# Altium project Z7_Lite.PrjPcb
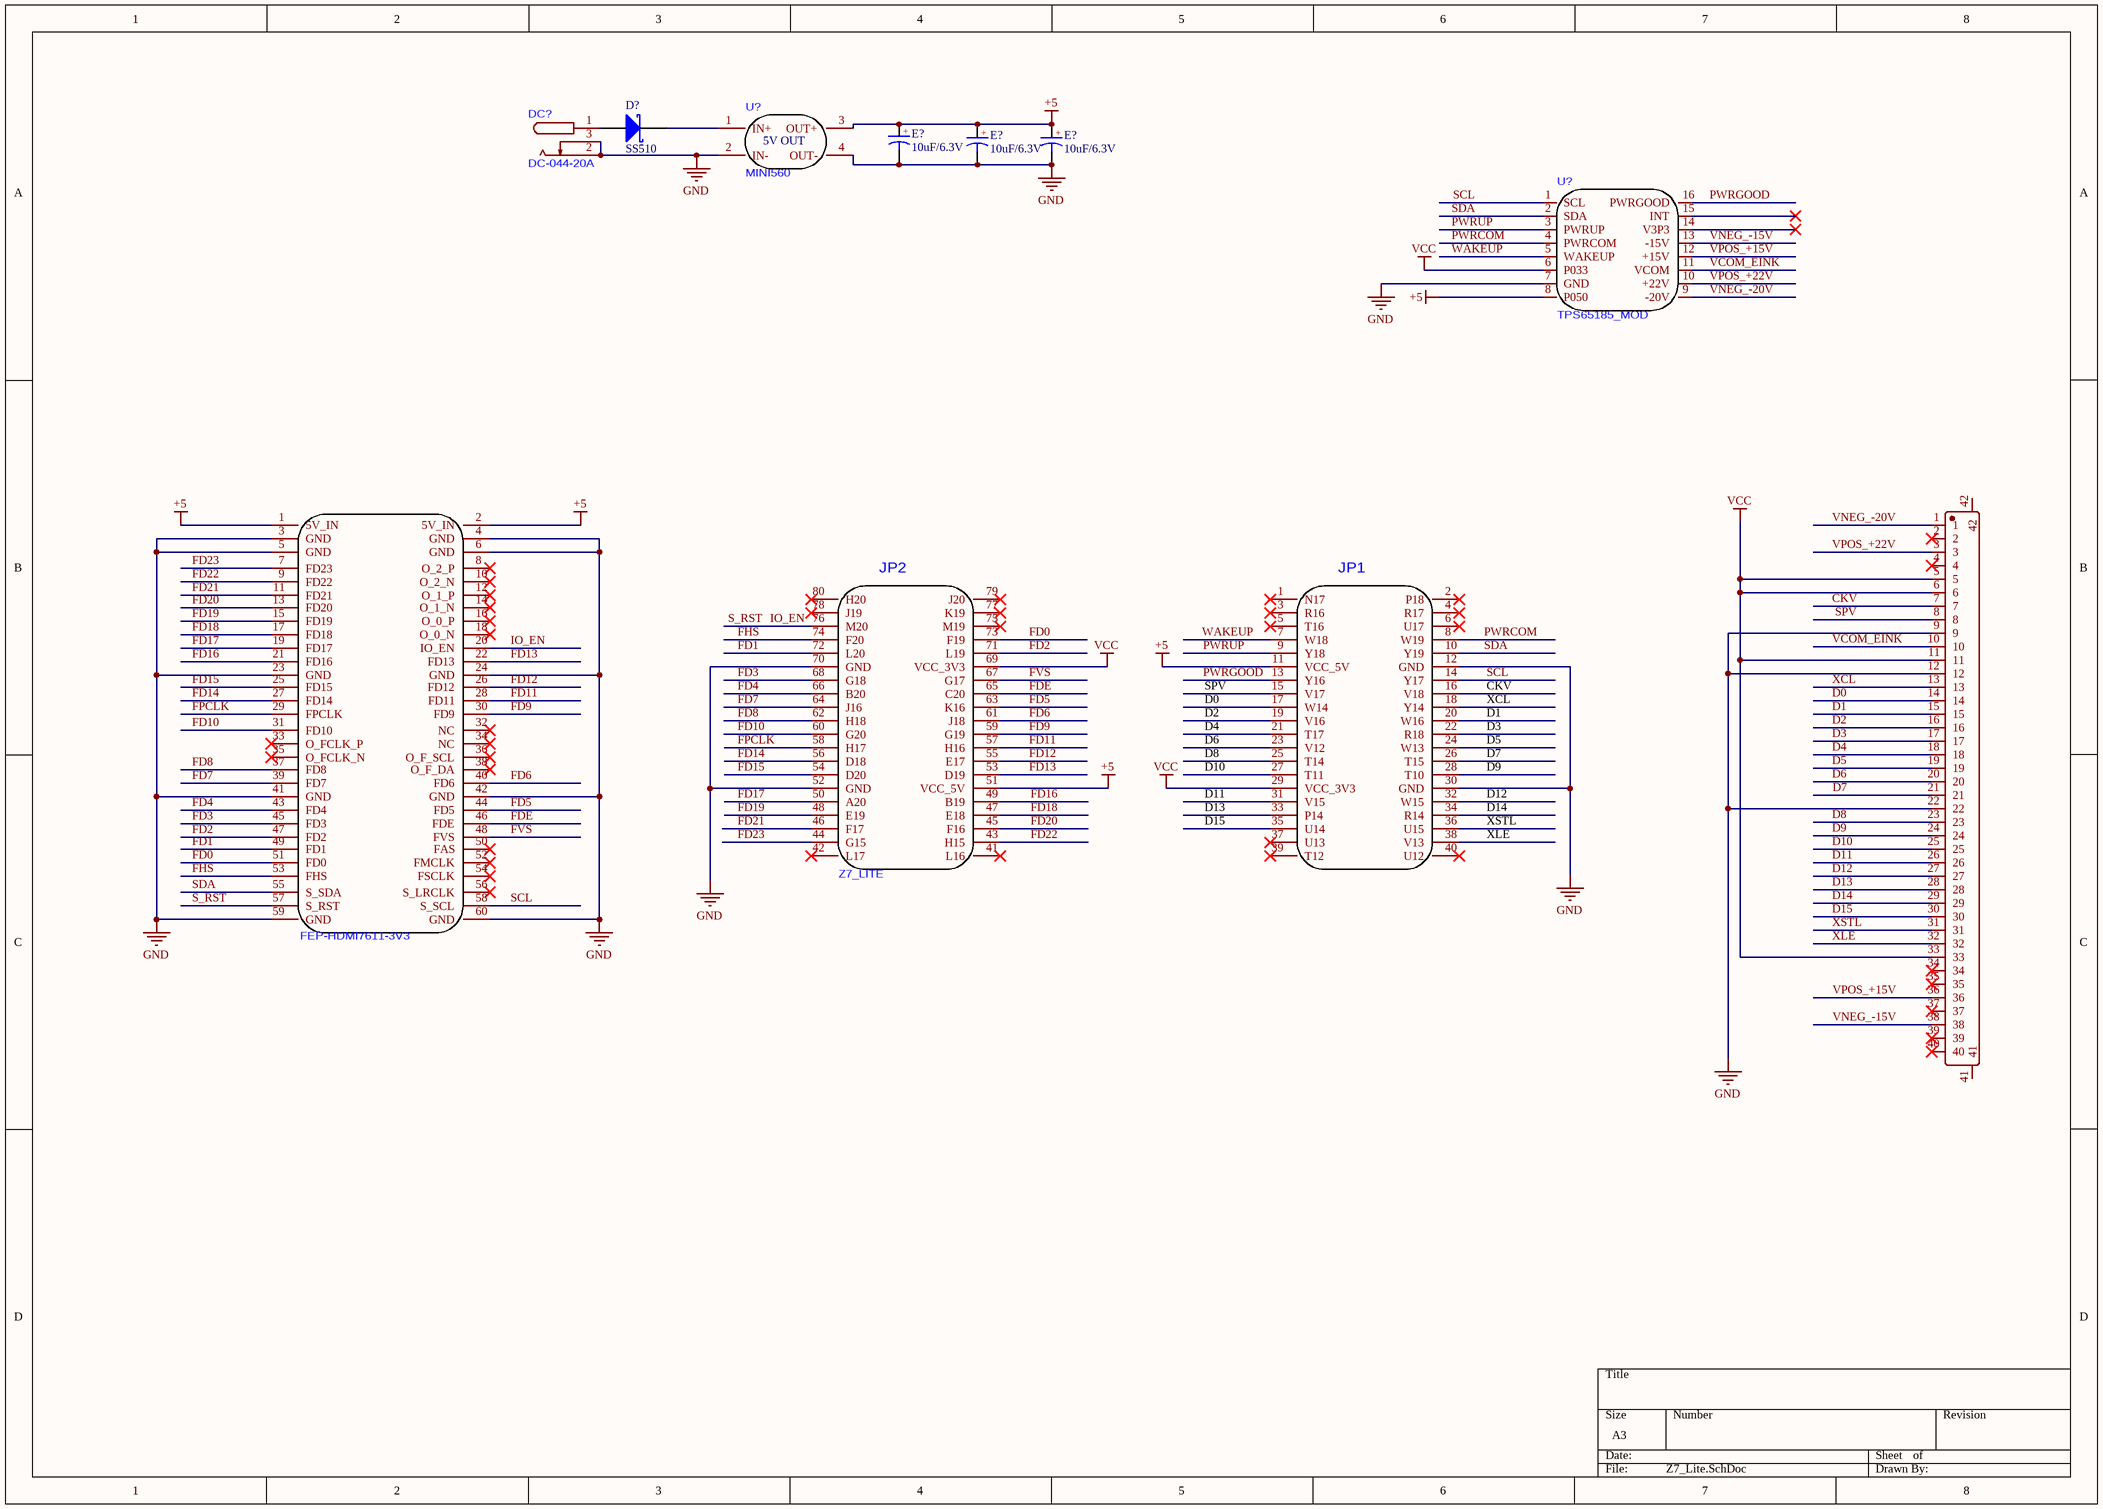
[diagram p0: Z7_Lite.SchDoc]
1 sheet, 10 parts. Net scope: global (net labels, ports and power ports of the same name join across sheets).
Board file: Z7_Lite.PcbDoc

## Sheet Z7_Lite.SchDoc
size A3; SheetNumber: 1; SheetTotal: 1

### Parts
(Parts that share a designator on the sheet are numbered #1, #2 ... from top to bottom, then left to right.)
D?  SS510  [SMB]
DC?  DC-044-20A  [DC-IN-TH_DC-044-20A]
E?#1  10uF/6.3V  [C_3528]
E?#2  10uF/6.3V  [C_3528]
E?#3  10uF/6.3V  [C_3528]
P?  FPCCONNECTOR 40PIN 0.5MM  [FPC-SMD_40P-P0.50_FG-H2.0-40P]  (value not drawn)
U?#1  MINI560  [MINI560]
U?#2  TPS65185_MOD  [TPS65185_MOD]
U?#3  Z7_LITE  [Z7_LITE]
U?#4  FEP-HDMI7611-3V3  [CONN-SMD_5177983-2]

### Nets
+5: E?#1.1(A) E?#2.1(A) E?#3.1(A) U?#1.3(OUT+) U?#2.8(P050) U?#3.11(VCC_5V) U?#3.51(VCC_5V) U?#4.1(5V_IN) U?#4.2(5V_IN)
GND: DC?.2 DC?.3 E?#1.2(K) E?#2.2(K) E?#3.2(K) P?.9 P?.12 P?.22 U?#1.2(IN-) U?#1.4(OUT-) U?#2.7(GND) U?#3.12(GND) U?#3.30(GND) U?#3.52(GND) U?#3.70(GND) U?#4.3(GND) U?#4.4(GND) U?#4.5(GND) U?#4.6(GND) U?#4.23(GND) U?#4.24(GND) U?#4.41(GND) U?#4.42(GND) U?#4.59(GND) U?#4.60(GND)
VCC: P?.5 P?.6 P?.11 P?.33 U?#2.6(P033) U?#3.29(VCC_3V3) U?#3.69(VCC_3V3)
CKV: P?.7 U?#3.16(V18)
D0: P?.14 U?#3.17(W14)
D1: P?.15 U?#3.20(W16)
D2: P?.16 U?#3.19(V16)
D3: P?.17 U?#3.22(R18)
D4: P?.18 U?#3.21(T17)
D5: P?.19 U?#3.24(W13)
D6: P?.20 U?#3.23(V12)
D7: P?.21 U?#3.26(T15)
D8: P?.23 U?#3.25(T14)
D9: P?.24 U?#3.28(T10)
D10: P?.25 U?#3.27(T11)
D11: P?.26 U?#3.31(V15)
D12: P?.27 U?#3.32(W15)
D13: P?.28 U?#3.33(P14)
D14: P?.29 U?#3.34(R14)
D15: P?.30 U?#3.35(U14)
FD0: U?#3.73(F19) U?#4.51(FD0)
FD1: U?#3.72(L20) U?#4.49(FD1)
FD2: U?#3.71(L19) U?#4.47(FD2)
FD3: U?#3.68(G18) U?#4.45(FD3)
FD4: U?#3.66(B20) U?#4.43(FD4)
FD5: U?#3.63(K16) U?#4.44(FD5)
FD6: U?#3.61(J18) U?#4.40(FD6)
FD7: U?#3.64(J16) U?#4.39(FD7)
FD8: U?#3.62(H18) U?#4.37(FD8)
FD9: U?#3.59(G19) U?#4.30(FD9)
FD10: U?#3.60(G20) U?#4.31(FD10)
FD11: U?#3.57(H16) U?#4.28(FD11)
FD12: U?#3.55(E17) U?#4.26(FD12)
FD13: U?#3.53(D19) U?#4.22(FD13)
FD14: U?#3.56(D18) U?#4.27(FD14)
FD15: U?#3.54(D20) U?#4.25(FD15)
FD16: U?#3.49(B19) U?#4.21(FD16)
FD17: U?#3.50(A20) U?#4.19(FD17)
FD18: U?#3.47(E18) U?#4.17(FD18)
FD19: U?#3.48(E19) U?#4.15(FD19)
FD20: U?#3.45(F16) U?#4.13(FD20)
FD21: U?#3.46(F17) U?#4.11(FD21)
FD22: U?#3.43(H15) U?#4.9(FD22)
FD23: U?#3.44(G15) U?#4.7(FD23)
FDE: U?#3.65(C20) U?#4.46(FDE)
FHS: U?#3.74(F20) U?#4.53(FHS)
FPCLK: U?#3.58(H17) U?#4.29(FPCLK)
FVS: U?#3.67(G17) U?#4.48(FVS)
IO_EN: U?#3.76(M20) U?#4.20(IO_EN) U?#4.57(S_RST)  [also labelled S_RST]
PWRCOM: U?#2.4(PWRCOM) U?#3.8(W19)
PWRGOOD: U?#2.16(PWRGOOD) U?#3.13(Y16)
PWRUP: U?#2.3(PWRUP) U?#3.9(Y18)
SCL: U?#2.1(SCL) U?#3.14(Y17) U?#4.58(S_SCL)
SDA: U?#2.2(SDA) U?#3.10(Y19) U?#4.55(S_SDA)
SPV: P?.8 U?#3.15(V17)
VCOM_EINK: P?.10 U?#2.11(VCOM)
VNEG_-15V: P?.38 U?#2.13(-15V)
VNEG_-20V: P?.1 U?#2.9(-20V)
VPOS_+15V: P?.36 U?#2.12(+15V)
VPOS_+22V: P?.3 U?#2.10(+22V)
WAKEUP: U?#2.5(WAKEUP) U?#3.7(W18)
XCL: P?.13 U?#3.18(Y14)
XLE: P?.32 U?#3.38(V13)
XSTL: P?.31 U?#3.36(U15)
NetD?_1: D?.1(A) DC?.1
NetD?_2: D?.2(K) U?#1.1(IN+)

Not connected (* = marked no-connect by the designer): P? 2* 4* 34* 35* 37* 39* 40* 41 42; U?#2 14(V3P3)* 15(INT)*; U?#3 1(N17)* 2(P18)* 3(R16)* 4(R17)* 5(T16)* 6(U17)* 37(U13)* 39(T12)* 40(U12)* 41(L16)* 42(L17)* 75(M19)* 77(K19)* 78(J19)* 79(J20)* 80(H20)*; U?#4 8(O_2_P)* 10(O_2_N)* 12(O_1_P)* 14(O_1_N)* 16(O_0_P)* 18(O_0_N)* 32(NC)* 33(O_FCLK_P)* 34(NC)* 35(O_FCLK_N)* 36(O_F_SCL)* 38(O_F_DA)* 50(FAS)* 52(FMCLK)* 54(FSCLK)* 56(S_LRCLK)*

### Notes on the sheet
- (near U?#1) 5V OUT
- (in symbol CT) +
- (in symbol Z7_LITE) JP2; JP1

### Library data of the parts
D? = SS510: 肖特基二极管; 0.1_属性: 100V/5A; 1.库作者: 冰凌猫; 2.库版本: v2.0_2021.03.30; 3.交流分享: Q群514746572,开源更新,欢迎一起交流学习PCB设计; 4.作者声明: 旨为整合最全库集,欢迎转载,禁止商用！-冰凌猫; 5.备注说明: 该库已二次整合过网上各热销库,基本最全,无需重复搜购安装; 0.0_BOM名称: 肖特基二极管
E?#1-E?#3 = CT: 贴片钽电容; 3.交流分享: Q群514746572,开源更新,欢迎一起交流学习PCB设计; 4.作者声明: 旨为整合最全库集,欢迎转载,禁止商用！-冰凌猫; 5.备注说明: 该库已二次整合过网上各热销库,基本最全,无需重复搜购安装; 1.库作者: 冰凌猫; 2.库版本: v2.0 (2021.03.30); 0.0_BOM名称: 贴片钽电容